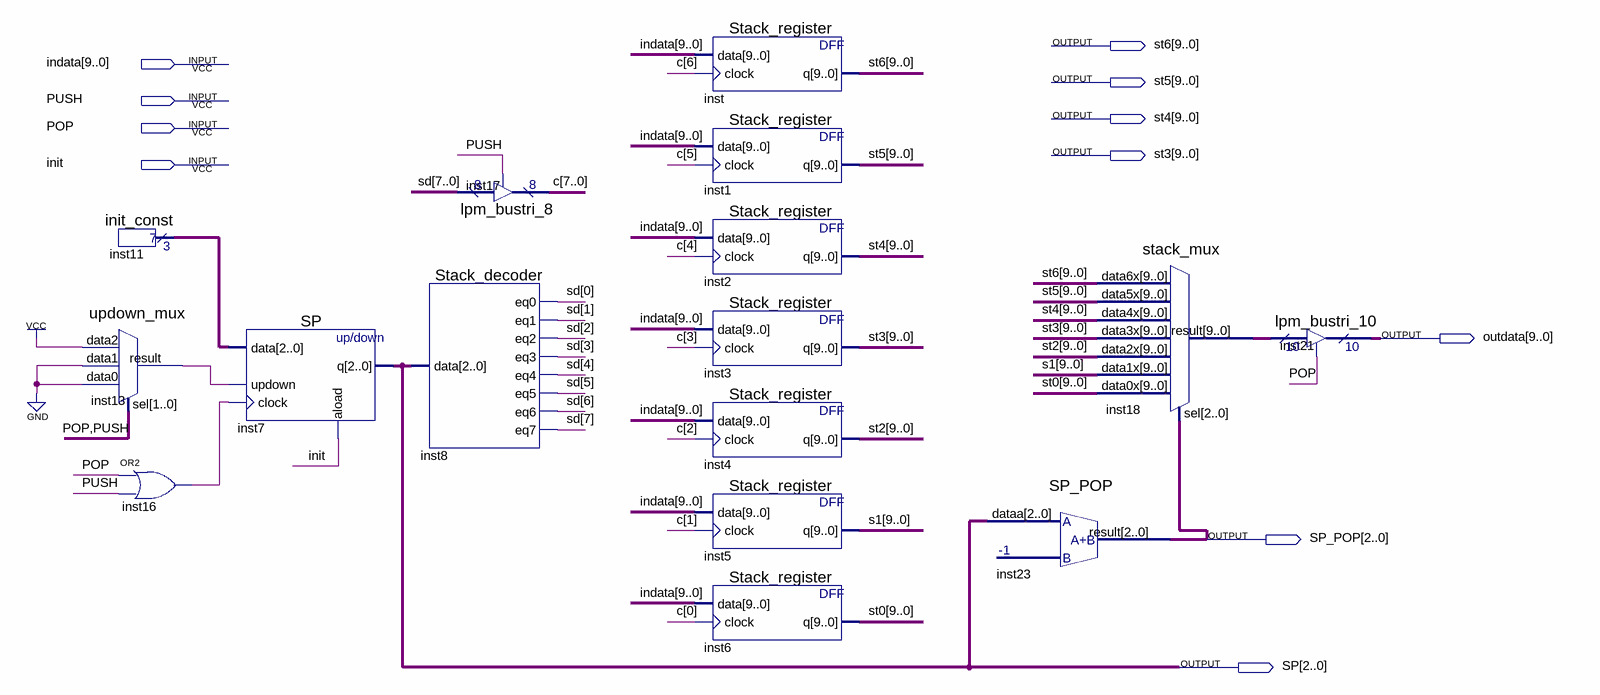
[diagram p0: schematic sheet]
// Quartus schematic Stack.bdf as structural Verilog: 16 symbols, 11 pins
module Stack (
  input  [9:0] indata,
  input  PUSH,
  input  POP,
  input  init,
  output [9:0] st6,
  output [9:0] st5,
  output [9:0] st4,
  output [9:0] st3,
  output [9:0] outdata,
  output [2:0] SP_POP,
  output [2:0] SP
);

  wire inst13_result, inst16_out;
  wire [2:0] inst11_result;
  wire [7:0] c, sd;
  wire [9:0] inst18_result, s1, st0, st2;

  init_const inst11 (.result(inst11_result));
  updown_mux inst13 (.data2(1'b1), .data1(1'b0), .data0(1'b0), .sel({POP, PUSH}), .result(inst13_result));
  or inst16 (inst16_out, POP, PUSH);
  SP inst7 (.data(inst11_result), .updown(inst13_result), .clock(inst16_out), .aload(init), .q(SP));
  lpm_bustri_8 inst17 (.enabledt(PUSH), .data(sd), .tridata(c));
  Stack_decoder inst8 (
    .data(SP), .eq0(sd[0]), .eq1(sd[1]), .eq2(sd[2]), .eq3(sd[3]), .eq4(sd[4]), .eq5(sd[5]), .eq6(sd[6]),
    .eq7(sd[7]));
  Stack_register inst (.data(indata), .clock(c[6]), .q(st6));
  Stack_register inst1 (.data(indata), .clock(c[5]), .q(st5));
  Stack_register inst2 (.data(indata), .clock(c[4]), .q(st4));
  Stack_register inst3 (.data(indata), .clock(c[3]), .q(st3));
  Stack_register inst4 (.data(indata), .clock(c[2]), .q(st2));
  Stack_register inst5 (.data(indata), .clock(c[1]), .q(s1));
  Stack_register inst6 (.data(indata), .clock(c[0]), .q(st0));
  SP_POP inst23 (.dataa(SP), .result(SP_POP));
  stack_mux inst18 (
    .data6x(st6), .data5x(st5), .data4x(st4), .data3x(st3), .data2x(st2), .data1x(s1), .data0x(st0),
    .sel(SP_POP), .result(inst18_result));
  lpm_bustri_10 inst21 (.enabledt(POP), .data(inst18_result), .tridata(outdata));
endmodule
